# Altium schematic sheet 02_MCU.SchDoc
size A4
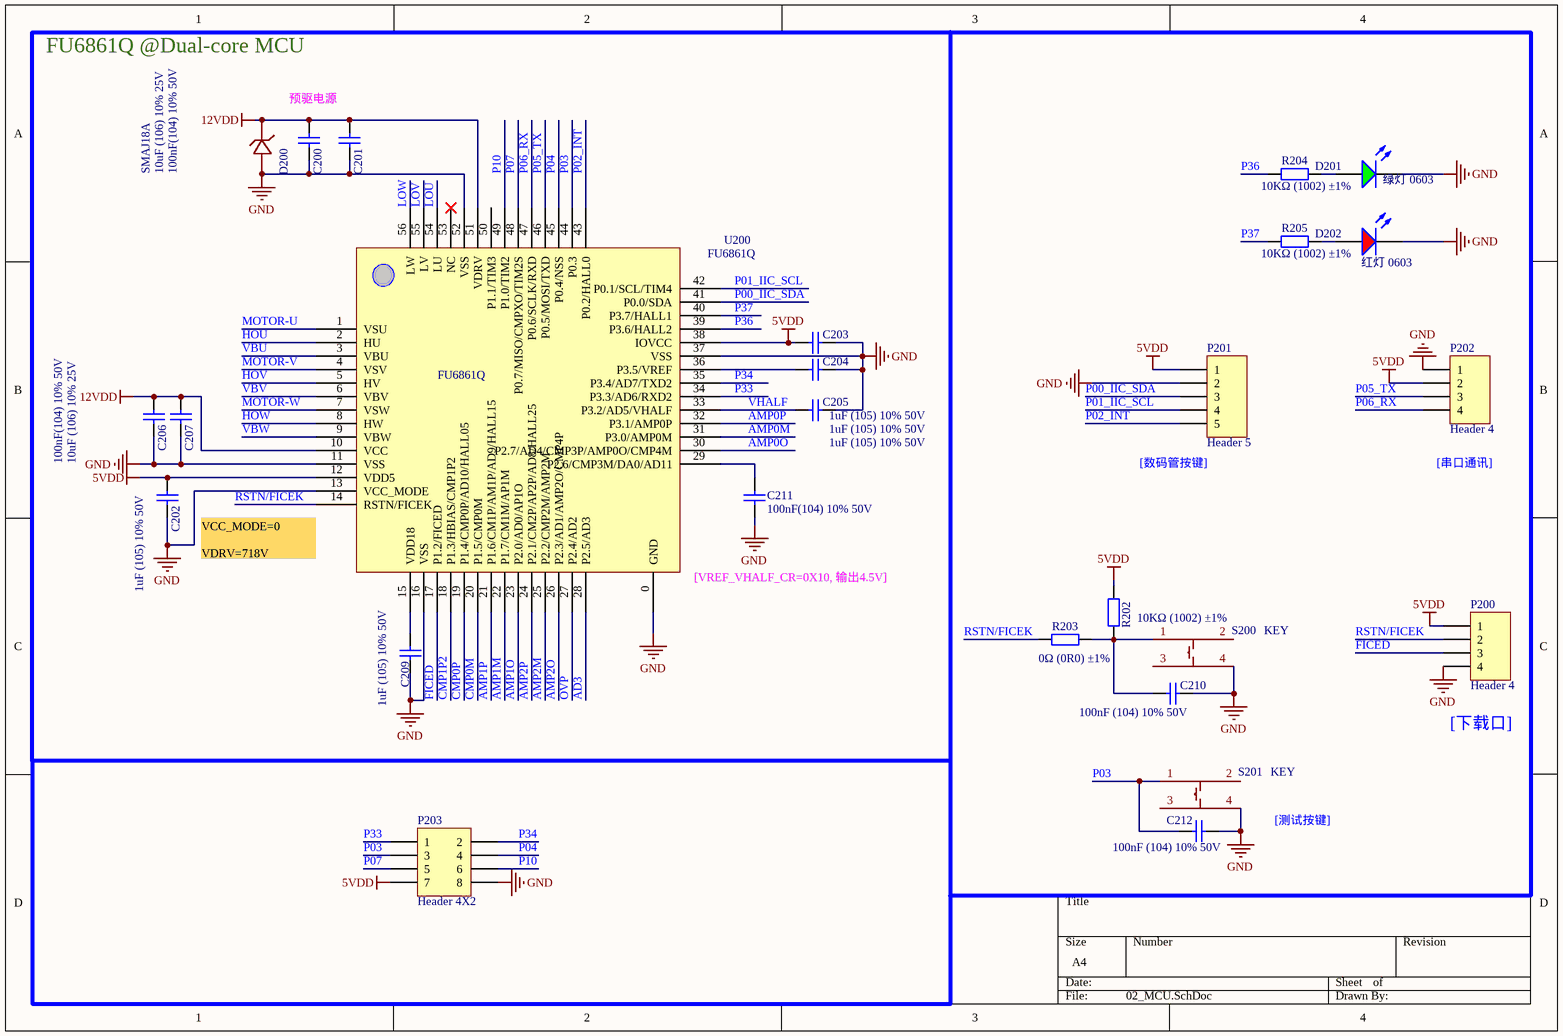
[diagram p0: 02_MCU.SchDoc]

## Parts
C200  10uF (106) 10% 25V  [0805_C]
C201  100nF(104) 10% 50V  [0805_C]
C202  1uF (105) 10% 50V  [0805_C]
C203  1uF (105) 10% 50V  [0805_C]
C204  1uF (105) 10% 50V  [0805_C]
C205  1uF (105) 10% 50V  [0805_C]
C206  10uF (106) 10% 25V  [0805_C]
C207  100nF(104) 10% 50V  [0805_C]
C209  1uF (105) 10% 50V  [0805_C]
C210  100nF (104) 10% 50V  [0603_C]
C211  100nF(104) 10% 50V  [0805_C]
C212  100nF (104) 10% 50V  [0603_C]
D200  SMAJ18A  [SMAJ18A]
D201  绿灯 0603  [0603_LED_S1]
D202  红灯 0603  [0603_LED_S1]
P200  Header 4  [HDR1X4]
P201  Header 5  [HDR1X5]
P202  Header 4  [HDR1X4]
P203  Header 4X2  [HDR2X4]
R202  10KΩ (1002) ±1%  [0603_R]
R203  0Ω (0R0) ±1%  [0603_R]
R204  10KΩ (1002) ±1%  [0805_R]
R205  10KΩ (1002) ±1%  [0805_R]
S200  KEY  [KEY_WHITE]
S201  KEY  [KEY_WHITE]
U200  FU6861Q  [FU6861Q]

## Nets
5VDD: C202.2 C203.1 P200.1 P201.1 P202.2 P203.7 R202.2 U200.12(VDD5) U200.38(IOVCC)
12VDD: C200.2 C201.2 C206.2 C207.2 D200.1(C) U200.10(VCC) U200.51(VDRV)
GND: C200.1 C201.1 C202.1 C203.2 C204.2 C205.2 C206.1 C207.1 C209.1 C210.2 C211.2 C212.1 D200.2(A) D201.K D202.K P200.4 P201.2 P202.1 P203.8 S200.4 S201.4 U200.0(GND) U200.11(VSS) U200.13(VCC_MODE) U200.16(VSS) U200.37(VSS) U200.52(VSS)
AD3: U200.28(P2.5/AD3)
AMP0M: U200.31(P3.0/AMP0M)
AMP0O: U200.30(P2.7/AD4/CMP3P/AMP0O/CMP4M)
AMP0P: U200.32(P3.1/AMP0P)
AMP1M: U200.22(P1.7/CM1M/AP1M)
AMP1O: U200.23(P2.0/AD0/AP1O)
AMP1P: U200.21(P1.6/CM1P/AM1P/AD9/HALL15)
AMP2M: U200.25(P2.2/CMP2M/AMP2M)
AMP2O: U200.26(P2.3/AD1/AMP2O/CMP4P)
AMP2P: U200.24(P2.1/CM2P/AP2P/AD8/HALL25)
CMP0M: U200.20(P1.5/CMP0M)
CMP0P: U200.19(P1.4/CMP0P/AD10/HALL05)
CMP1P2: U200.18(P1.3/HBIAS/CMP1P2)
FICED: P200.3 U200.17(P1.2/FICED)
HOU: U200.2(HU)
HOV: U200.5(HV)
HOW: U200.8(HW)
LOU: U200.54(LU)
LOV: U200.55(LV)
LOW: U200.56(LW)
MOTOR-U: U200.1(VSU)
MOTOR-V: U200.4(VSV)
MOTOR-W: U200.7(VSW)
OVP: U200.27(P2.4/AD2)
P00_IIC_SDA: P201.3 U200.41(P0.0/SDA)
P01_IIC_SCL: P201.4 U200.42(P0.1/SCL/TIM4)
P02_INT: P201.5 U200.43(P0.2/HALL0)
P03: C212.2 P203.3 S201.1 U200.44(P0.3)
P04: P203.4 U200.45(P0.4/NSS)
P05_TX: P202.3 U200.46(P0.5/MOSI/TXD)
P06_RX: P202.4 U200.47(P0.6/SCLK/RXD)
P07: P203.5 U200.48(P0.7/MISO/CMPXO/TIM2S)
P10: P203.6 U200.49(P1.0/TIM2)
P33: P203.1 U200.34(P3.3/AD6/RXD2)
P34: P203.2 U200.35(P3.4/AD7/TXD2)
P36: R204.1 U200.39(P3.6/HALL2)
P37: R205.1 U200.40(P3.7/HALL1)
RSTN/FICEK: P200.2 R203.1 U200.14(RSTN/FICEK)
VBU: U200.3(VBU)
VBV: U200.6(VBV)
VBW: U200.9(VBW)
VHALF: C205.1 U200.33(P3.2/AD5/VHALF)
NetC204_1: C204.1 U200.36(P3.5/VREF)
NetC209_2: C209.2 U200.15(VDD18)
NetC210_1: C210.1 R202.1 R203.2 S200.1
NetC211_1: C211.1 U200.29(P2.6/CMP3M/DA0/AD11)
NetD201_A: D201.A R204.2
NetD202_A: D202.A R205.2

Not connected (* = marked no-connect by the designer): S200 2 3; S201 2 3; U200 50(P1.1/TIM3) 53(NC)*

## Notes on the sheet
- FU6861Q @Dual-core MCU
- 预驱电源
- (near P201) [数码管按键]
- (near P202) [串口通讯]
- VCC_MODE=0
  VDRV=718V
- (near U200) [VREF_VHALF_CR=0X10, 输出4.5V]
- (near P200) [下载口]
- [测试按键]

## Library data of the parts
C200 C206 = 0805 10uF (106) 10% 25V: 贴片电容; ComponentLink1Description: 供应商链接; ComponentLink1URL: http://www.szlcsc.com/product/details_16532.html; Package: 0805; Supplier: LC; SuppliersPartNumber: C15850
C201 C207 C211 = 0805 100nF(104) 10% 50V: 贴片电容; ComponentLink1Description: 供应商链接; ComponentLink1URL: http://www.szlcsc.com/product/details_50686.html; Package: 0805; Supplier: LC; SuppliersPartNumber: C49678
C202-C205 C209 = 0805 1uF (105) 10% 50V: 贴片电容; ComponentLink1Description: 供应商链接; ComponentLink1URL: http://www.szlcsc.com/product/details_29074.html; Package: 0805; Supplier: LC; SuppliersPartNumber: C28323
C210 C212 = 0603 100nF (104) 10% 50V: 贴片电容; ComponentLink1Description: 供应商链接; ComponentLink1URL: http://www.szlcsc.com/product/details_15331.html; Package: 0603; Supplier: LC; SuppliersPartNumber: C14663
D200 = SMAJ18A: C435545
D201 = 0603 绿灯: 发光二极管; ComponentLink1Description: 供应商链接; ComponentLink1URL: http://www.szlcsc.com/product/details_73152.html; Package: 0603; Supplier: LC; SuppliersPartNumber: C72043
D202 = 0603 红灯: 发光二极管; ComponentLink1Description: 供应商链接; ComponentLink1URL: http://www.szlcsc.com/product/details_2659.html; Package: 0603; Supplier: LC; SuppliersPartNumber: C2286
P200 P202 = Header 4: Header, 4-Pin; LatestRevisionDate: 17-Jul-2002; LatestRevisionNote: Re-released for DXP Platform.; Publisher: Altium Limited
P201 = Header 5: Header, 5-Pin; LatestRevisionDate: 17-Jul-2002; LatestRevisionNote: Re-released for DXP Platform.; Publisher: Altium Limited
P203 = Header 4X2: Header, 4-Pin, Dual row; LatestRevisionDate: 17-Jul-2002; LatestRevisionNote: Re-released for DXP Platform.; Publisher: Altium Limited
R202 = 0603 10KΩ (1002) 1%: 贴片电阻; ComponentLink1Description: 供应商链接; ComponentLink1URL: http://www.szlcsc.com/product/details_26547.html; Package: 0603; Supplier: LC; SuppliersPartNumber: C25804
R203 = 0603 0Ω (0R0) 1%: 贴片电阻; ComponentLink1Description: 供应商链接; ComponentLink1URL: http://www.szlcsc.com/product/details_21903.html; Package: 0603; Supplier: LC; SuppliersPartNumber: C21189
R204 R205 = 0805 10KΩ (1002) 1%: 贴片电阻; ComponentLink1Description: 供应商链接; ComponentLink1URL: http://www.szlcsc.com/product/details_18102.html; Package: 0805; Supplier: LC; SuppliersPartNumber: C17414
S200 S201 = KEY: 白色方块